# EAGLE design G824A (EAGLE 6.6.0)
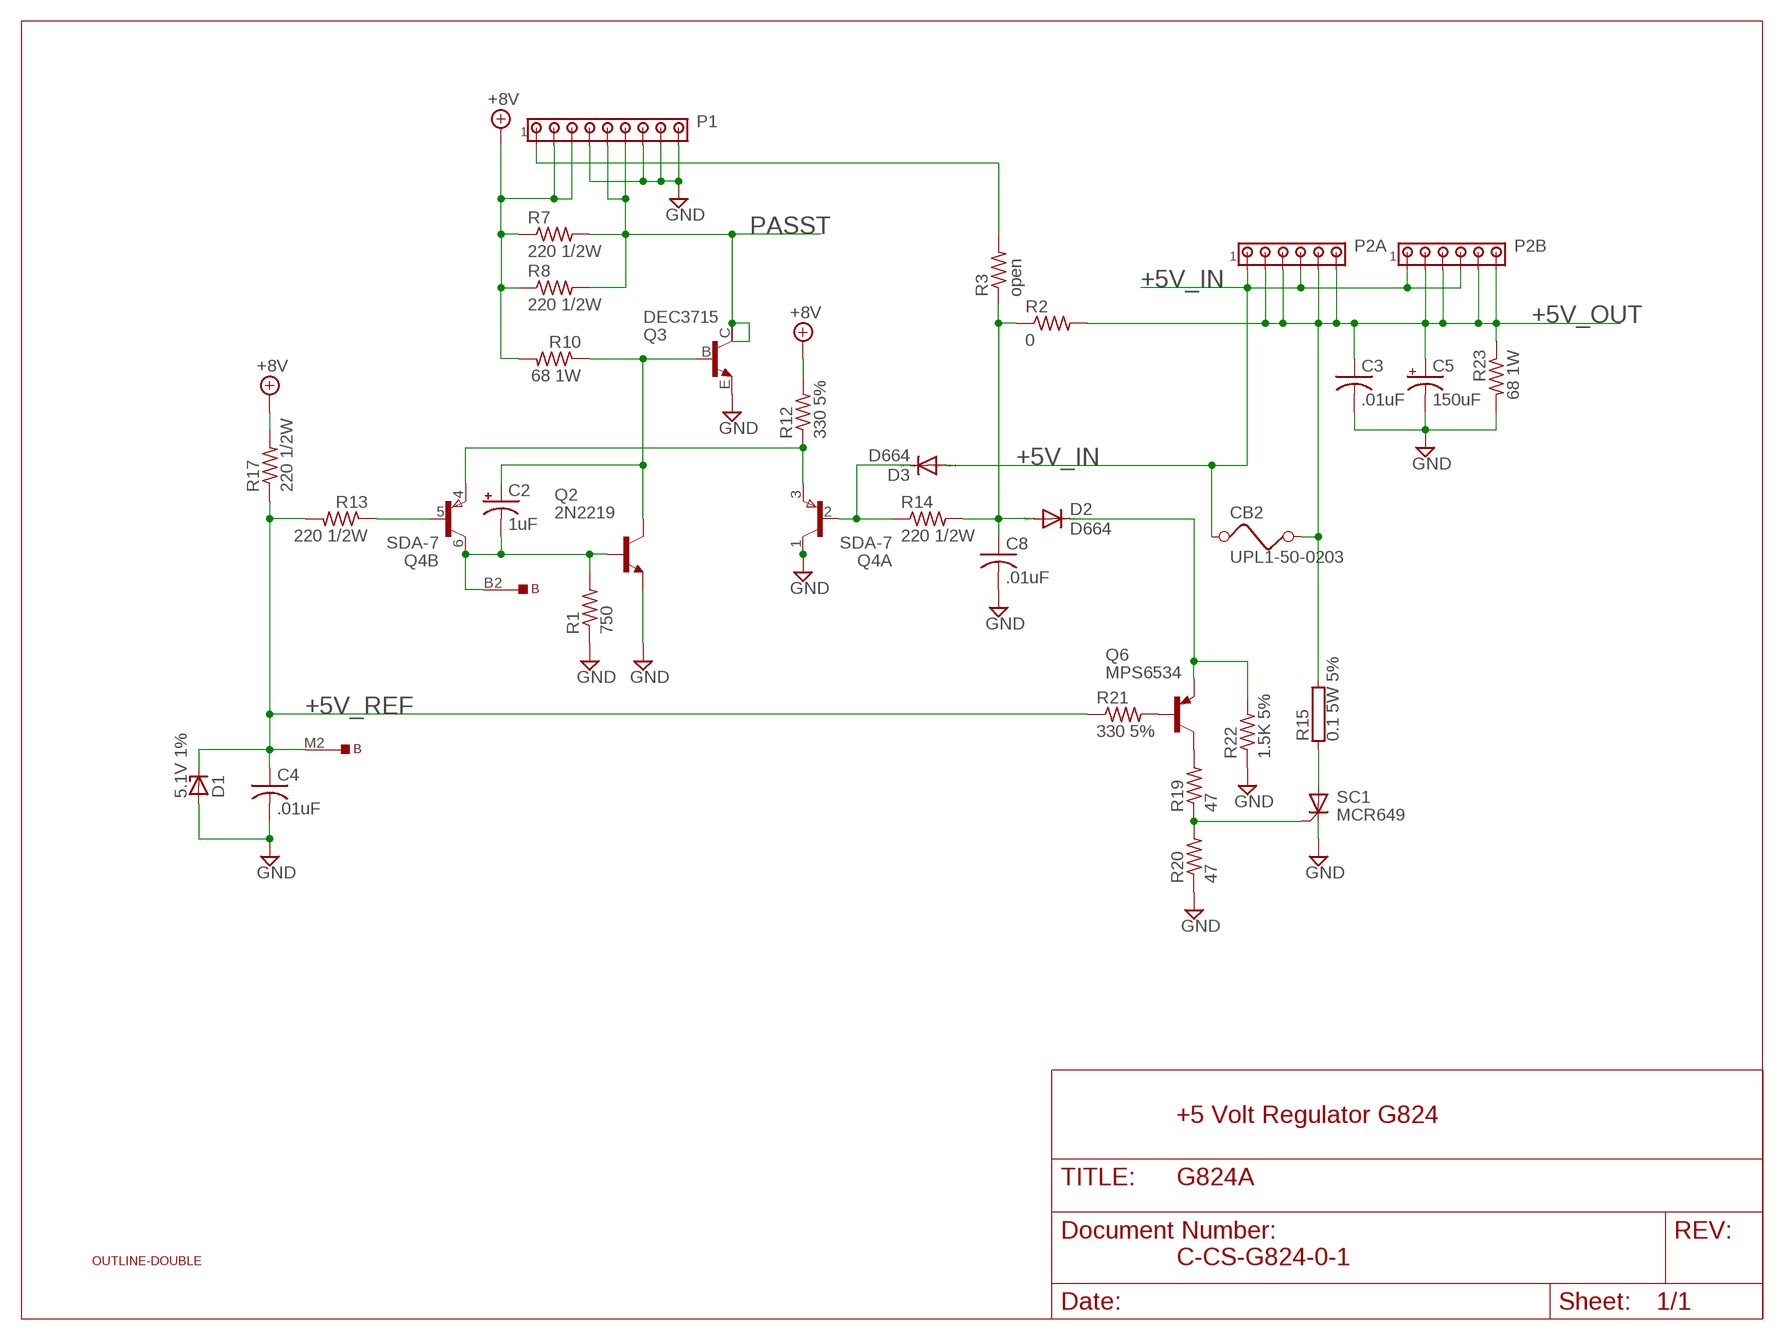
[diagram p0: schematic, sheet 1]

## Parts
B  EDGE-TOP  [EDGE-CON2]
C2  1uF  CPOL-USE15-5AXIAL  [E15-5]
C3  .01uF  C-US  [C063-025X075]
C4  .01uF  C-US  [C063-025X075]
C5  150uF  CPOL-USE20-8AXIAL  [E12-8]
C8  .01uF  C-US  [C063-025X075]
CB2  UPL1-50-0203  UPL1-50  [UPL1-50]
D1  5.1V 1%  ZENER-DIODEDO41Z10  [DO41Z10]
D2  D664  DIODE-DO35-10  [DO35-10]
D3  D664  DIODE-DO35-10  [DO35-10]
P1  350432-1  [350432-1]
P2A  350431-1  [350431-1]
P2B  350431-1  [350431-1]
Q2  2N2219  [TO5]
Q3  DEC3715  2N3772  [TO3]
Q4  SDA-7  MAT-03H  [TO78]
Q6  MPS6534  -PNP-TO5  [TO5]
R1  750  R-US_0207/10  [0207/10]
R2  0  R-US_0207/10  [0207/10]
R3  open  R-US_0207/10  [0207/10]
R7  220 1/2W  R-US_0411/15  [0411/15]
R8  220 1/2W  R-US_0411/15  [0411/15]
R10  68 1W  R-US_0414/20  [0414/20]
R12  330 5%  R-US_0207/10  [0207/10]
R13  220 1/2W  R-US_0411/15  [0411/15]
R14  220 1/2W  R-US_0411/15  [0411/15]
R15  0.1 5W 5%  RHPS932  [HPS932]
R17  220 1/2W  R-US_0411/15  [0411/15]
R19  47  R-US_0207/10  [0207/10]
R20  47  R-US_0207/10  [0207/10]
R21  330 5%  R-US_0207/10  [0207/10]
R22  1.5K 5%  R-US_0207/10  [0207/10]
R23  68 1W  R-US_0414/20  [0414/20]
SC1  MCR649  [TO3A]
U$1  OUTLINE-DOUBLE  [DOUBLE]

## Nets
+5V_IN: CB2.1 D3.A P2A.1 P2A.4 P2B.1 P2B.4
+5V_OUT: C3.1 C5.+ CB2.2 P2A.2 P2A.3 P2A.5 P2A.6 P2B.2 P2B.3 P2B.5 P2B.6 R2.2 R15.2 R23.1
+5V_REF: B.M2 C4.1 D1.C R13.2 R17.1 R21.1
+8V: P1.2 P1.3 R7.1 R8.1 R10.2 R12.2 R17.2
GND: C3.2 C4.2 C5.- C8.2 D1.A P1.4 P1.7 P1.8 P1.9 Q2.1(E) Q3.E Q4.1(A:C) R1.1 R20.1 R22.1 R23.2 SC1.1(C)
N$1: Q4.5(B:B) R13.1
N$3: Q4.3(A:E) Q4.4(B:E) R12.1
N$4: B.B2 C2.- Q2.2(B) Q4.6(B:C) R1.2
N$5: P1.1 R3.2
N$6: D3.C Q4.2(A:B) R14.1
N$9: C2.+ Q2.3(C) Q3.B R10.1
N$12: Q6.2(B) R21.2
N$13: Q6.3(C) R19.2
N$14: R19.1 R20.2 SC1.2(G)
N$15: D2.C Q6.1(E) R22.2
N$17: C8.1 D2.A R2.1 R3.1 R14.2
N$18: R15.1 SC1.3(A)
PASST: P1.5 P1.6 Q3.C Q3.C/(C) R7.2 R8.2
Unconnected: B.A1 B.A2 B.B1 B.C1 B.C2 B.D1 B.D2 B.E1 B.E2 B.F1 B.F2 B.H1 B.H2 B.J1 B.J2 B.K1 B.K2 B.L1 B.L2 B.M1 B.N1 B.N2 B.P1 B.P2 B.R1 B.R2 B.S1 B.S2 B.T1 B.T2 B.U1 B.U2 B.V1 B.V2

## Notes on the sheet
- +5 Volt Regulator G824
- C-CS-G824-0-1

## Library data of the parts
B = dec-con:EDGE-TOP: Labeled DEC edge connector, suitable for top connector.
C2 = dec-con:CPOL-USE15-5AXIAL: 0.6" veresion of an electrolytic
C3 C4 C8 = dec-con:C-US: Capacitors with funky DEC lead spacing.
C5 = dec-con:CPOL-USE20-8AXIAL: A 0.8 inch electrolytic.
CB2 = dec-con:UPL1-50: UPL Single Pole Circuit Breaker
D1 = diode:ZENER-DIODE: Z-Diode
D2 D3 = diode:DIODE-: DIODE
P1 = con-amp:350432-1: Universal MATE-N-LOK .250" Centerline, 600 V, 19 - 36 A max Source: http://catalog.tycoelectronics.com/ .. ENG_CD_350432_W.pdf
P2A P2B = con-amp:350431-1: Universal MATE-N-LOK .250" Centerline, 600 V, 19 - 36 A max Source: http://catalog.tycoelectronics.com/ .. ENG_CD_350431_Y.pdf
Q2 = transistor-npn:2N2219: NPN Transistor
Q3 = transistor-neu-to92:2N3772: NPN TRANSISTOR
Q4 = linear:MAT-03H: Dual TRANSISTOR
Q6 = transistor:*-PNP-: PNP Transistror
R1-R3 R7 R8 R12-R14 R17 R19-R22 = rcl:R-US_: RESISTOR, American symbol
R10 R23 = dec-con:R-US_0414/20: 0.8" Resistor
R15 = resistor-power:R: Power Resitor; OC_FARNELL: unknown; OC_NEWARK: unknown
SC1 = dec-con:MCR649: Power SCR
U$1 = dec-con:OUTLINE-*: Board outlines for DEC boards.

## Net classes
0 default: width 0.813 mm

## Board
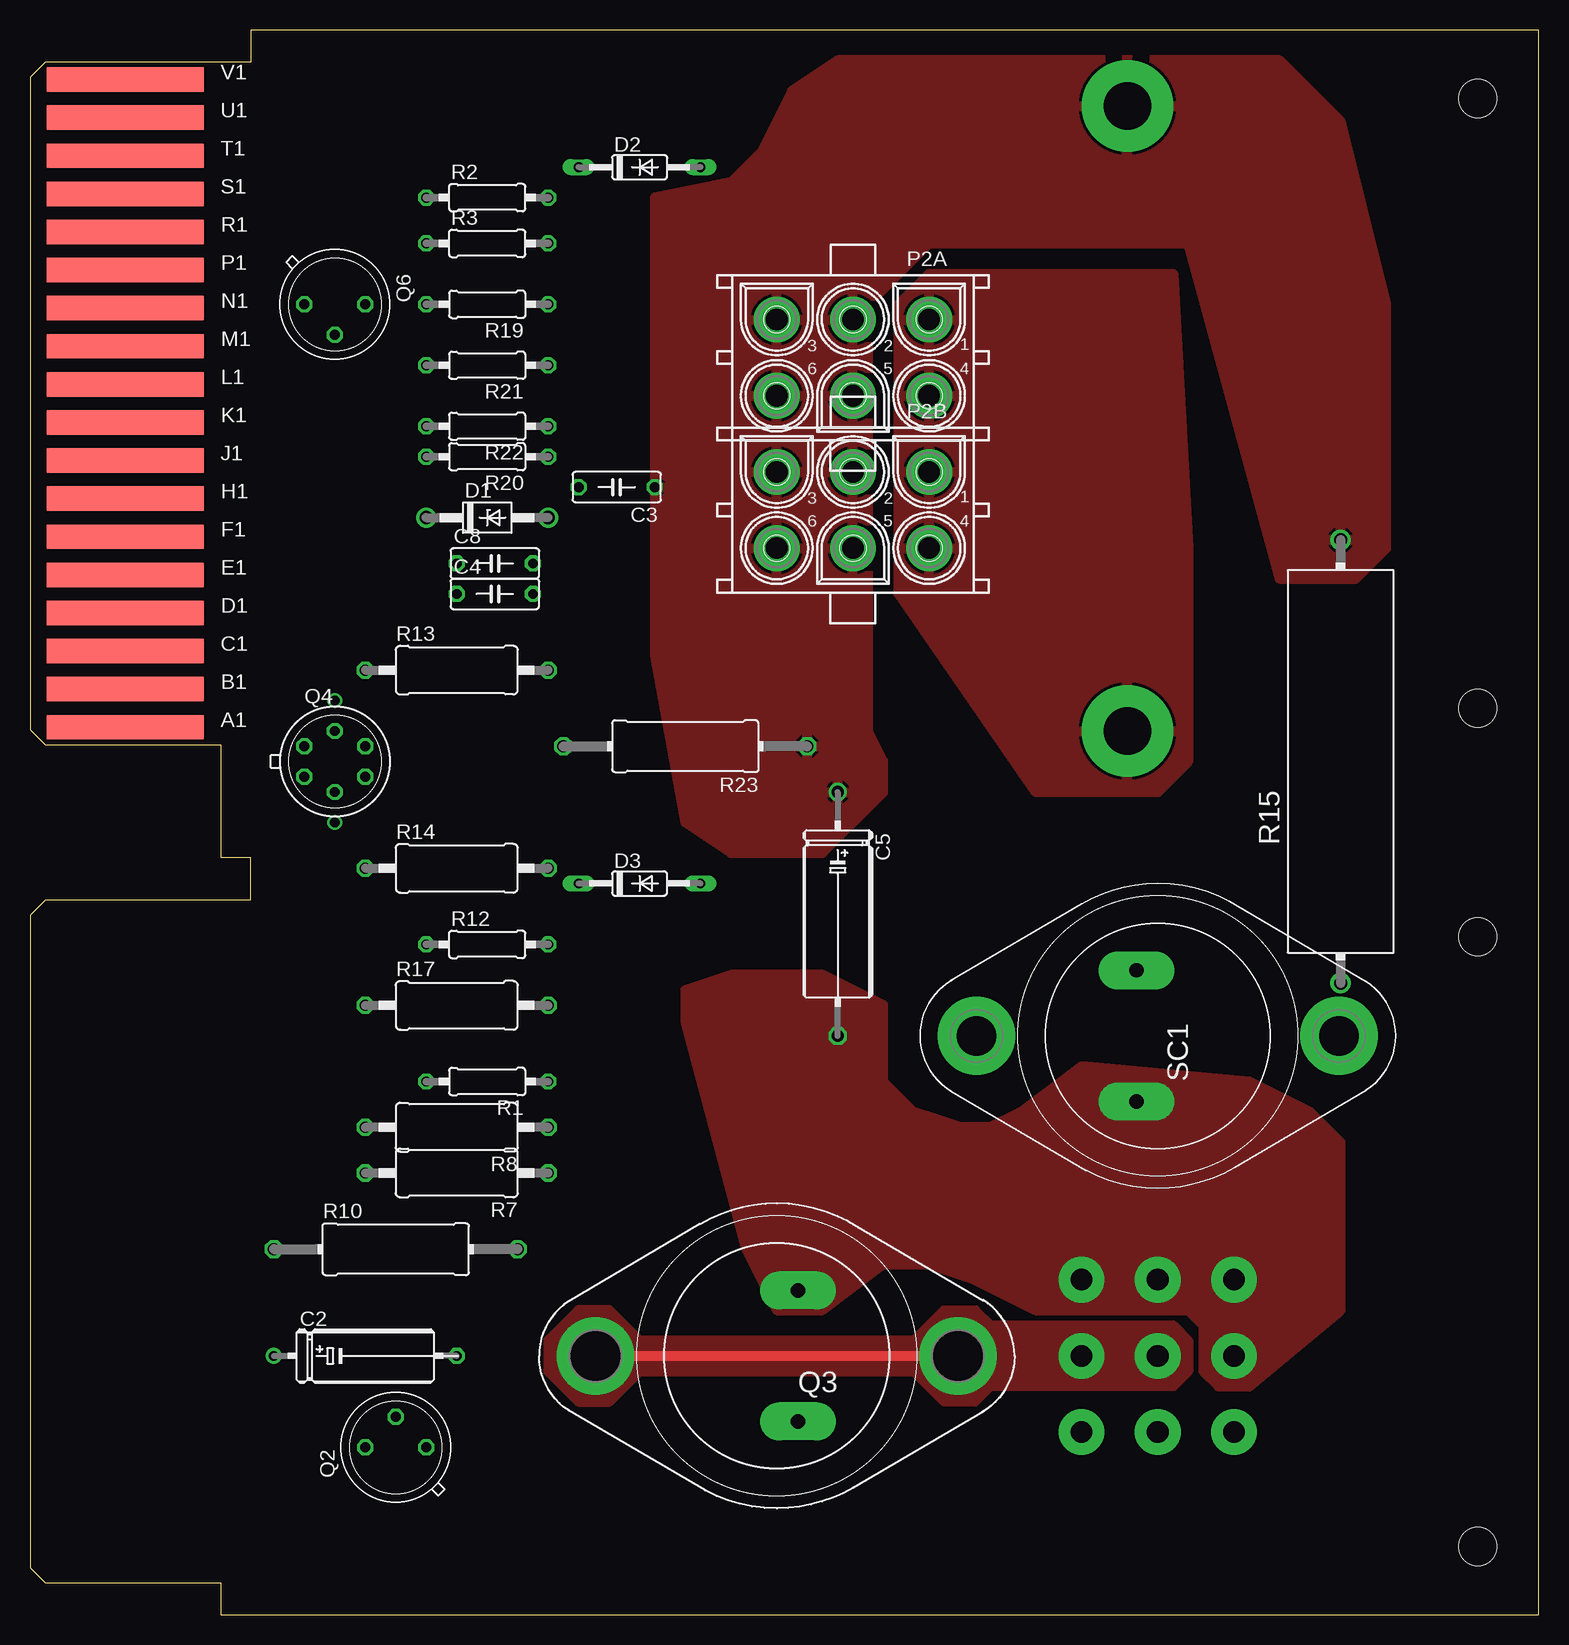
[diagram p1: board, top side]
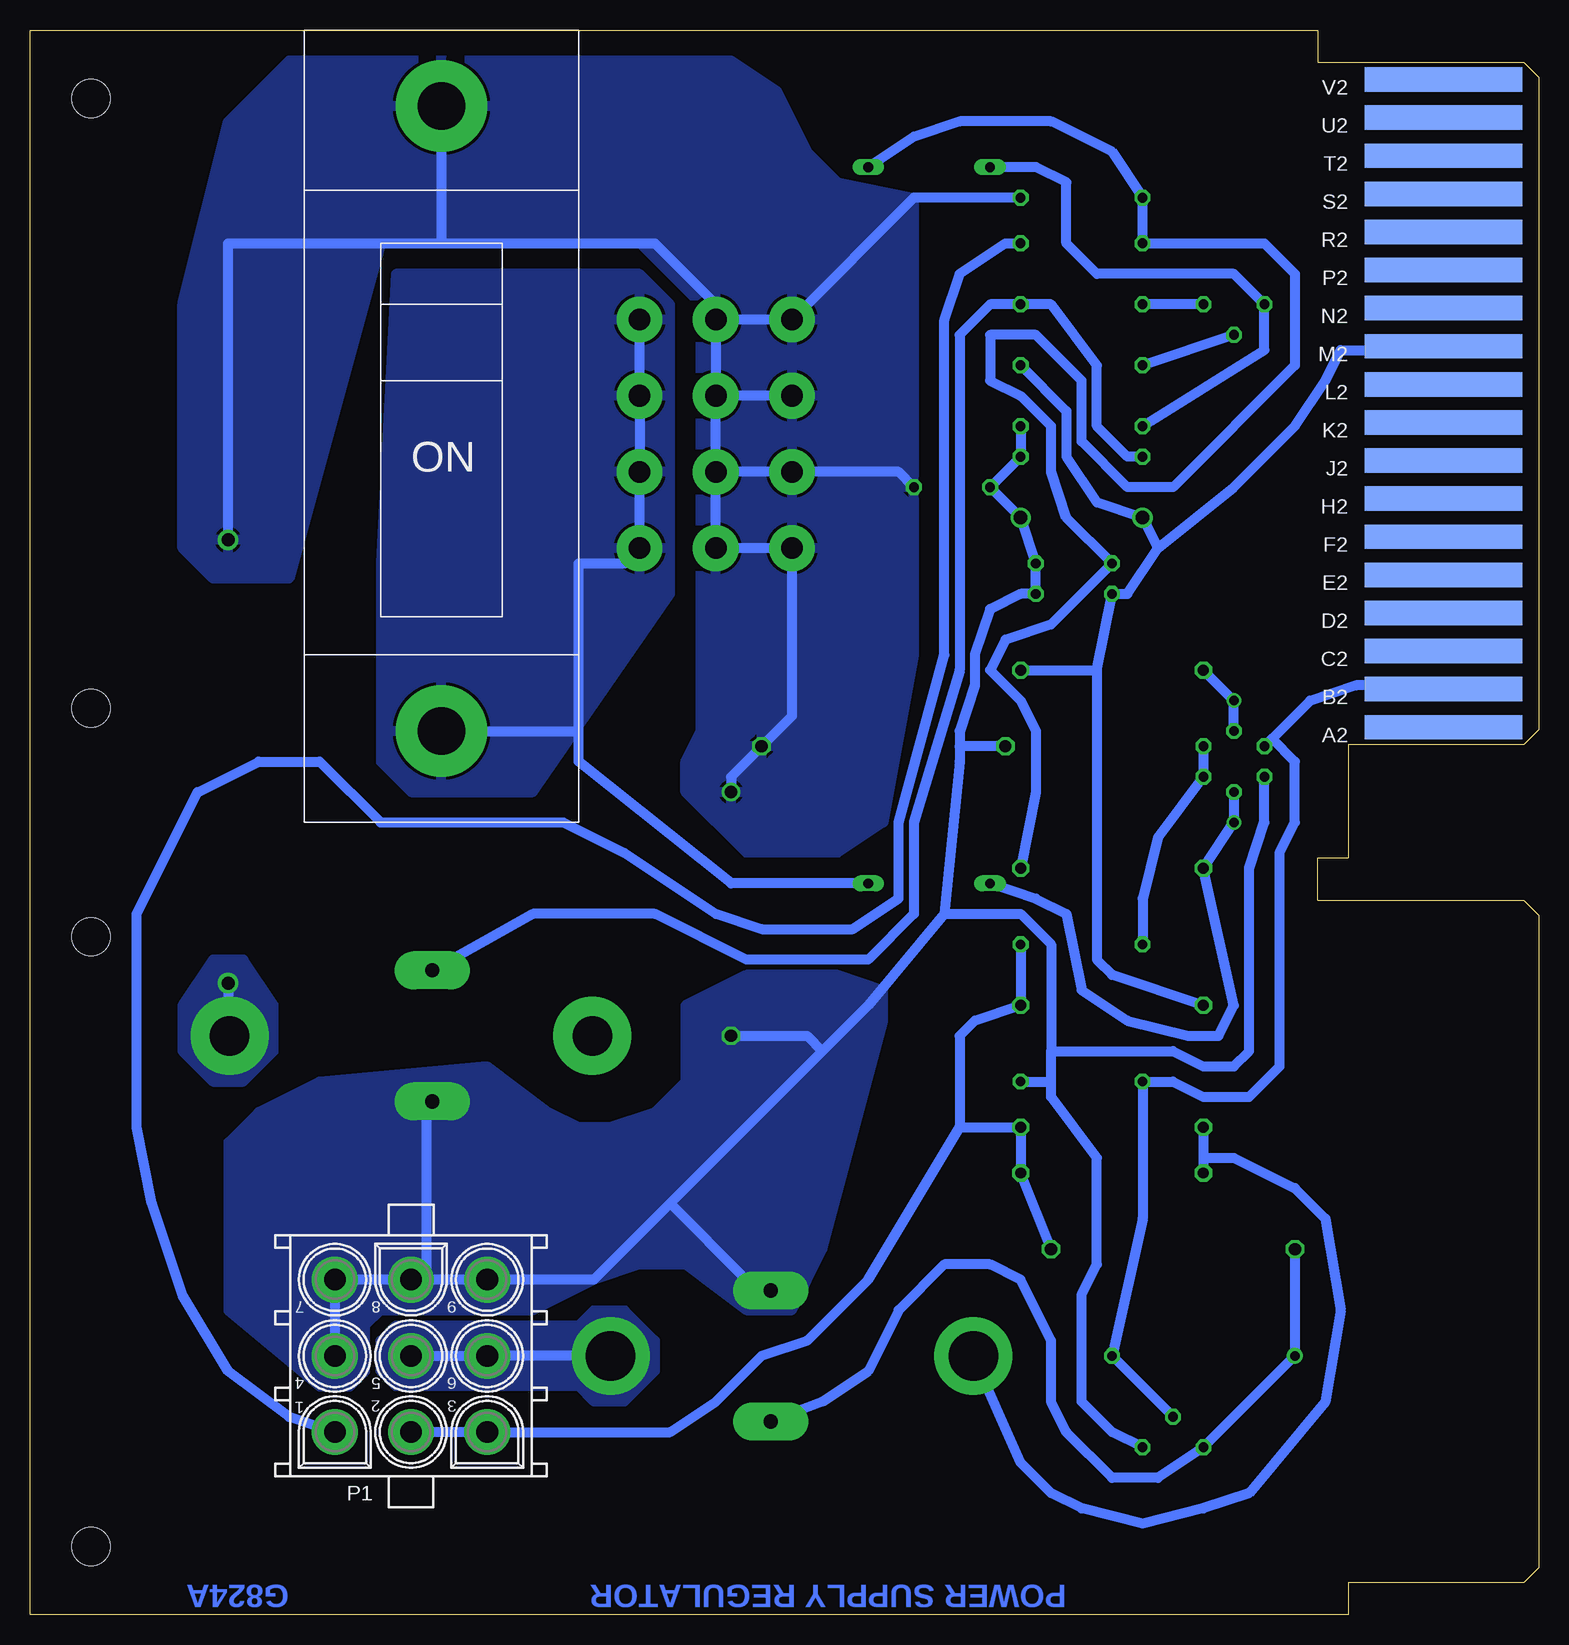
[diagram p2: board, bottom side, seen from below]

Size 125.73 x 132.08 mm. Coordinates in mm from the lower left corner, seen from the top.
Copper layers (1+16): Top 0.035mm / dielectric 1.5mm / Bottom 0.035mm
Design rules "16mils": minimum track width 16mil, minimum drill 32mil, track to track 15mil, track to pad 10mil, pad to pad 10mil, via to via 10mil, smd to smd 10mil, copper to edge 13mil, drill to drill 10mil, minimum pad ring 10mil, minimum via ring 8mil, stop-mask expansion 0mil, vias tented up to drill 0mil, thermal gap 10mil

### Footprints (pad centres in the part's own frame; a part is rotated, then mirrored left to right if it is on the bottom)
EDGE-CON2 = smd 13.106 x 2.032: A1 7.938,4.128; B1 7.938,7.303; C1 7.938,10.477; D1 7.938,13.652; E1 7.938,16.828; F1 7.938,20.003; H1 7.938,23.177; J1 7.938,26.352; K1 7.938,29.527; L1 7.938,32.703; M1 7.938,35.877; N1 7.938,39.053; P1 7.938,42.227; R1 7.938,45.403; S1 7.938,48.578; T1 7.938,51.752; U1 7.938,54.928; V1 7.938,58.102 | smd 13.106 x 2.032 bottom: A2 7.938,4.128; B2 7.938,7.303; C2 7.938,10.477; D2 7.938,13.652; E2 7.938,16.828; F2 7.938,20.003; H2 7.938,23.177; J2 7.938,26.352; K2 7.938,29.527; L2 7.938,32.703; M2 7.938,35.877; N2 7.938,39.053; P2 7.938,42.227; R2 7.938,45.403; S2 7.938,48.578; T2 7.938,51.752; U2 7.938,54.928; V2 7.938,58.102
E15-5 = drill 0.813: + -7.62,0 | drill 0.813 octagon: - 7.62,0
C063-025X075 = drill 0.813 octagon: 1 -2.54,0; 2 3.81,0
E12-8 = drill 1.016: + -10.16,0 | drill 1.016 octagon: - 10.16,0
UPL1-50 = drill 3.962 pad 7.62: 1 25.4,0; 2 -26.67,0
DO41Z10 = drill 1.118: A 5.08,0; C -5.08,0
DO35-10 = drill 0.813 long: A 5.08,0; C -5.08,0
350432-1 = drill 1.8 pad 3.81: 1 6.35,6.35; 2 0,6.35; 3 -6.35,6.35; 4 6.35,0; 5 0,0; 6 -6.35,0; 7 6.35,-6.35; 8 0,-6.35; 9 -6.35,-6.35
350431-1 = drill 1.8 pad 3.81: 1 6.35,0; 2 0,0; 3 -6.35,0; 4 6.35,-6.35; 5 0,-6.35; 6 -6.35,-6.35
TO5 = drill 0.813 octagon: 1 0,-2.54; 2 2.54,0; 3 0,2.54
TO3 = drill 1.194 pad 3.15 long: B -1.778,5.461; E -1.778,-5.461 | drill 4.115 pad 6.477: C 15.113,0; C/ -15.113,0
TO78 = drill 0.813 octagon: 1 -2.54,-1.27; 2 0,-2.54; 3 2.54,-1.27; 4 2.54,1.27; 5 0,2.54; 6 -2.54,1.27
0207/10 = drill 0.813 octagon: 1 -5.08,0; 2 5.08,0
0411/15 = drill 0.914 octagon: 1 -7.62,0; 2 7.62,0
0414/20 = drill 1.016 octagon: 1 -10.16,0; 2 10.16,0
HPS932 = drill 1.1 pad 1.7: 1 -18.47,0; 2 18.47,0
TO3A = drill 1.194 pad 3.15 long: 1 -1.778,-5.461; 2 -1.778,5.461 | drill 3.302 pad 6.477: 3 15.113,0; 4 -15.113,0
DOUBLE = hole 3.175: 120.65,56.515; 120.65,5.715; 120.65,75.565; 120.65,126.365

### Placement (x,y rotation side)
B  0,69.85 0 top
C2  27.94,21.59 0 top
C3  49.53,93.98 180 top
C4  38.1,85.09 0 top
C5  67.31,58.42 270 top
C8  38.1,87.63 0 top
CB2  91.44,99.06 270 bottom
D1  38.1,91.44 0 top
D2  50.8,120.65 0 top
D3  50.8,60.96 0 top
P1  93.98,21.59 180 bottom
P2A  68.58,107.95 0 top
P2B  68.58,95.25 0 top
Q2  30.48,13.97 90 top
Q3  62.23,21.59 180 top
Q4  25.4,71.12 0 top
Q6  25.4,109.22 270 top
R1  38.1,44.45 180 top
R2  38.1,118.11 0 top
R3  38.1,114.3 0 top
R7  35.56,36.83 180 top
R8  35.56,40.64 180 top
R10  30.48,30.48 0 top
R12  38.1,55.88 0 top
R13  35.56,78.74 0 top
R14  35.56,62.23 0 top
R15  109.22,71.12 90 top
R17  35.56,50.8 0 top
R19  38.1,109.22 180 top
R20  38.1,96.52 180 top
R21  38.1,104.14 180 top
R22  38.1,99.06 180 top
R23  54.61,72.39 180 top
SC1  93.98,48.26 0 top
U$1  0,0 0 top

### Tracks (layer width: path | path; a pad name or v marks a point on that pad's centre or on a via)
+5V_IN
  Bottom 0.813: P2A.1 P2A.4 P2B.1 P2B.4 76.2,87.63 80.01,87.63 80.01,73.66 | D3.A 67.31,60.96 80.01,71.12 80.01,73.66 | CB2.1 90.17,73.66 80.01,73.66
  pour Bottom: 96.52,71.12 93.98,68.58 83.82,68.58 72.39,85.09 72.39,109.22 74.93,111.76 95.25,111.76 96.52,87.63
  pour Top: 72.39,109.22 74.93,111.76 95.25,111.76 96.52,88.9 96.52,71.12 93.98,68.58 83.82,68.58 72.39,85.09
+5V_OUT
  Bottom 0.813: P2B.2 P2B.3 53.34,95.25 C3.1 | P2A.6 P2A.5 | P2A.2 P2A.3 52.07,118.11 R2.2 | P2A.2 P2A.5 | P2B.2 P2A.5 | P2B.2 P2B.5 P2B.6 62.23,74.93 R23.1 67.31,69.85 C5.+ | R15.2 109.22,114.3 91.44,114.3 | 91.44,114.3 73.66,114.3 68.58,109.22 P2A.2 | CB2.2 91.44,114.3
  pour Bottom: 52.07,118.11 52.07,80.01 54.61,66.04 58.42,63.5 66.04,63.5 71.12,68.58 71.12,71.12 69.85,73.66 69.85,109.22 74.93,114.3 96.52,114.3 104.14,86.36 110.49,86.36 113.03,88.9 113.03,109.22 109.22,124.46 104.14,129.54 67.31,129.54 63.5,127 60.96,121.92 58.42,119.38
  pour Top: 104.14,86.36 110.49,86.36 113.03,88.9 113.03,109.22 109.22,124.46 104.14,129.54 67.31,129.54 63.5,127 60.96,121.92 58.42,119.38 52.07,118.11 52.07,80.01 54.61,66.04 58.42,63.5 66.04,63.5 71.12,68.58 71.12,71.12 69.85,73.66 69.85,109.22 74.93,114.3 96.52,114.3
+5V_REF
  Bottom 0.813: R21.1 39.37,100.33 39.37,96.52 36.83,92.71 D1.C 31.75,88.9 | 31.75,88.9 25.4,93.98 20.32,99.06 17.78,102.87 16.51,105.41 8.89,105.41 B.M2 | R13.2 36.83,78.74 | 36.83,78.74 C4.1 34.29,85.09 31.75,88.9 | 36.83,78.74 36.83,54.61 35.56,53.34 R17.1
+8V
  Bottom 0.813: P1.2 P1.3 72.39,15.24 68.58,17.78 64.77,21.59 60.96,22.86 55.88,27.94 48.26,40.64 | R10.2 R7.1 R8.1 48.26,40.64 | R12.2 R17.2 46.99,49.53 48.26,48.26 48.26,40.64
GND
  Bottom 0.813: 48.26,72.39 48.26,73.66 46.99,77.47 46.99,80.01 45.72,83.82 43.18,85.09 C4.2 C8.2 D1.A C3.2 R20.1 R22.1 | 48.26,72.39 48.26,71.12 49.53,58.42 | 49.53,58.42 43.18,58.42 40.64,55.88 40.64,46.99 | 40.64,46.99 30.48,46.99 27.94,45.72 25.4,45.72 24.13,46.99 24.13,62.23 22.86,66.04 Q4.1 | 92.71,27.94 P1.9 78.74,27.94 72.39,34.29 | 92.71,27.94 P1.8 P1.7 P1.4 | 49.53,58.42 55.88,50.8 59.69,46.99 | 59.69,46.99 72.39,34.29 | Q2.1 35.56,15.24 38.1,17.78 38.1,26.67 36.83,29.21 36.83,38.1 40.64,43.18 40.64,44.45 | 40.64,44.45 40.64,46.99 | R1.1 40.64,44.45 | R23.2 48.26,72.39 | C5.- 60.96,48.26 59.69,46.99 | Q3.E 66.04,27.94 72.39,34.29 | SC1.1 92.71,41.91 92.71,27.94
  pour Bottom (no thermals): 58.42,53.34 66.04,53.34 71.12,50.8 71.12,44.45 73.66,41.91 77.47,40.64 80.01,40.64 82.55,41.91 87.63,45.72 101.6,44.45 106.68,41.91 109.22,39.37 109.22,25.4 101.6,19.05 99.06,19.05 97.79,20.32 97.79,24.13 96.52,25.4 83.82,25.4 78.74,27.94 74.93,29.21 71.12,29.21 66.04,25.4 62.23,25.4 59.69,30.48 54.61,49.53 54.61,52.07
  pour Top (no thermals): 62.23,25.4 66.04,25.4 71.12,29.21 74.93,29.21 78.74,27.94 83.82,25.4 96.52,25.4 97.79,24.13 97.79,20.32 99.06,19.05 101.6,19.05 109.22,25.4 109.22,39.37 106.68,41.91 101.6,44.45 87.63,45.72 82.55,41.91 80.01,40.64 77.47,40.64 73.66,41.91 71.12,44.45 71.12,50.8 66.04,53.34 58.42,53.34 54.61,52.07 54.61,49.53 59.69,30.48
N$1  (via drill 0.81)
  Bottom 0.813: Q4.5 v25.4,76.2 R13.1
N$3
  Bottom 0.813: Q4.4 Q4.3 31.75,64.77 33.02,59.69 R12.1
N$4
  Bottom 0.813: B.B2 8.89,77.47 15.24,77.47 19.05,76.2 22.23,73.03 | Q4.6 22.23,73.03 | Q2.2 C2.- 33.02,33.02 R1.2 30.48,44.45 27.94,43.18 24.13,43.18 21.59,45.72 21.59,63.5 20.32,66.04 20.32,71.12 22.23,73.03
N$5
  Bottom 0.813: P1.1 104.14,16.51 109.22,20.32 113.03,26.67 115.57,34.29 116.84,40.64 116.84,58.42 111.76,68.58 106.68,71.12 101.6,71.12 96.52,66.04 81.28,66.04 76.2,63.5 68.58,58.42 64.77,57.15 57.15,57.15 53.34,59.69 53.34,66.04 49.53,80.01 49.53,107.95 48.26,111.76 44.45,114.3 R3.2
N$6  (via drill 0.81)
  Bottom 0.813: Q4.2 v25.4,66.04 R14.1 25.4,50.8 26.67,48.26 29.21,48.26 34.29,49.53 38.1,52.07 39.37,58.42 41.91,59.69 D3.C
N$9
  Bottom 0.813: R10.1 C2.+ Q2.3 31.75,11.43 35.56,11.43 39.37,15.24 40.64,17.78 40.64,22.86 43.18,27.94 45.72,29.21 49.53,29.21 53.34,25.4 55.88,20.32 59.69,17.78 Q3.B
N$12
  Bottom 0.813: Q6.2 R21.2
N$13
  Bottom 0.813: Q6.3 R19.2
N$14
  Bottom 0.813: R20.2 34.29,96.52 36.83,99.06 36.83,104.14 40.64,109.22 R19.1 45.72,109.22 48.26,106.68 48.26,78.74 52.07,66.04 52.07,58.42 55.88,54.61 66.04,54.61 73.66,58.42 83.82,58.42 SC1.2
N$15
  Bottom 0.813: R22.2 22.86,105.41 Q6.1 25.4,111.76 36.83,111.76 39.37,114.3 39.37,119.38 41.91,120.65 D2.C
N$17
  Bottom 0.813: R14.2 41.91,68.58 41.91,73.66 43.18,76.2 45.72,78.74 44.45,81.28 40.64,82.55 C8.1 39.37,91.44 40.64,95.25 40.64,99.06 43.18,101.6 45.72,102.87 45.72,106.68 41.91,106.68 38.1,102.87 38.1,97.79 34.29,93.98 30.48,93.98 20.32,104.14 20.32,111.76 22.86,114.3 R3.1 R2.1 35.56,121.92 40.64,124.46 48.26,124.46 52.07,123.19 D2.A
N$18
  Bottom 0.813: SC1.3 R15.1
  pour Bottom (no thermals): 107.95,54.61 110.49,54.61 113.03,50.8 113.03,46.99 110.49,44.45 107.95,44.45 105.41,46.99 105.41,50.8
PASST
  Top 0.813: 46.99,21.59 Q3.C Q3.C/
  Bottom 0.813: P1.5 P1.6 Q3.C/ | 27.94,38.1 R7.2 | R8.2 27.94,38.1 | 27.94,38.1 25.4,38.1 20.32,35.56 17.78,33.02 16.51,25.4 17.78,17.78 24.13,10.16 27.94,8.89 33.02,7.62 38.1,8.89 40.64,10.16 43.18,12.7 Q3.C
  pour Top (no thermals): 95.25,24.13 96.52,22.86 96.52,20.32 95.25,19.05 80.01,19.05 78.74,17.78 76.2,17.78 73.66,20.32 73.66,22.86 76.2,25.4 78.74,25.4 80.01,24.13
  pour Bottom (no thermals): 78.74,25.4 76.2,25.4 73.66,22.86 73.66,20.32 76.2,17.78 78.74,17.78 80.01,19.05 95.25,19.05 96.52,20.32 96.52,22.86 95.25,24.13 80.01,24.13
  pour Top (no thermals): 45.72,25.4 43.18,22.86 43.18,20.32 45.72,17.78 48.26,17.78 50.8,20.32 73.66,20.32 76.2,17.78 76.2,22.86 50.8,22.86 48.26,25.4

### Text on the board
Bottom: POWER SUPPLY REGULATOR | G824A